# Altium schematic sheet SIM.SchDoc
size A3; SheetNumber: 12; SheetTotal: 15
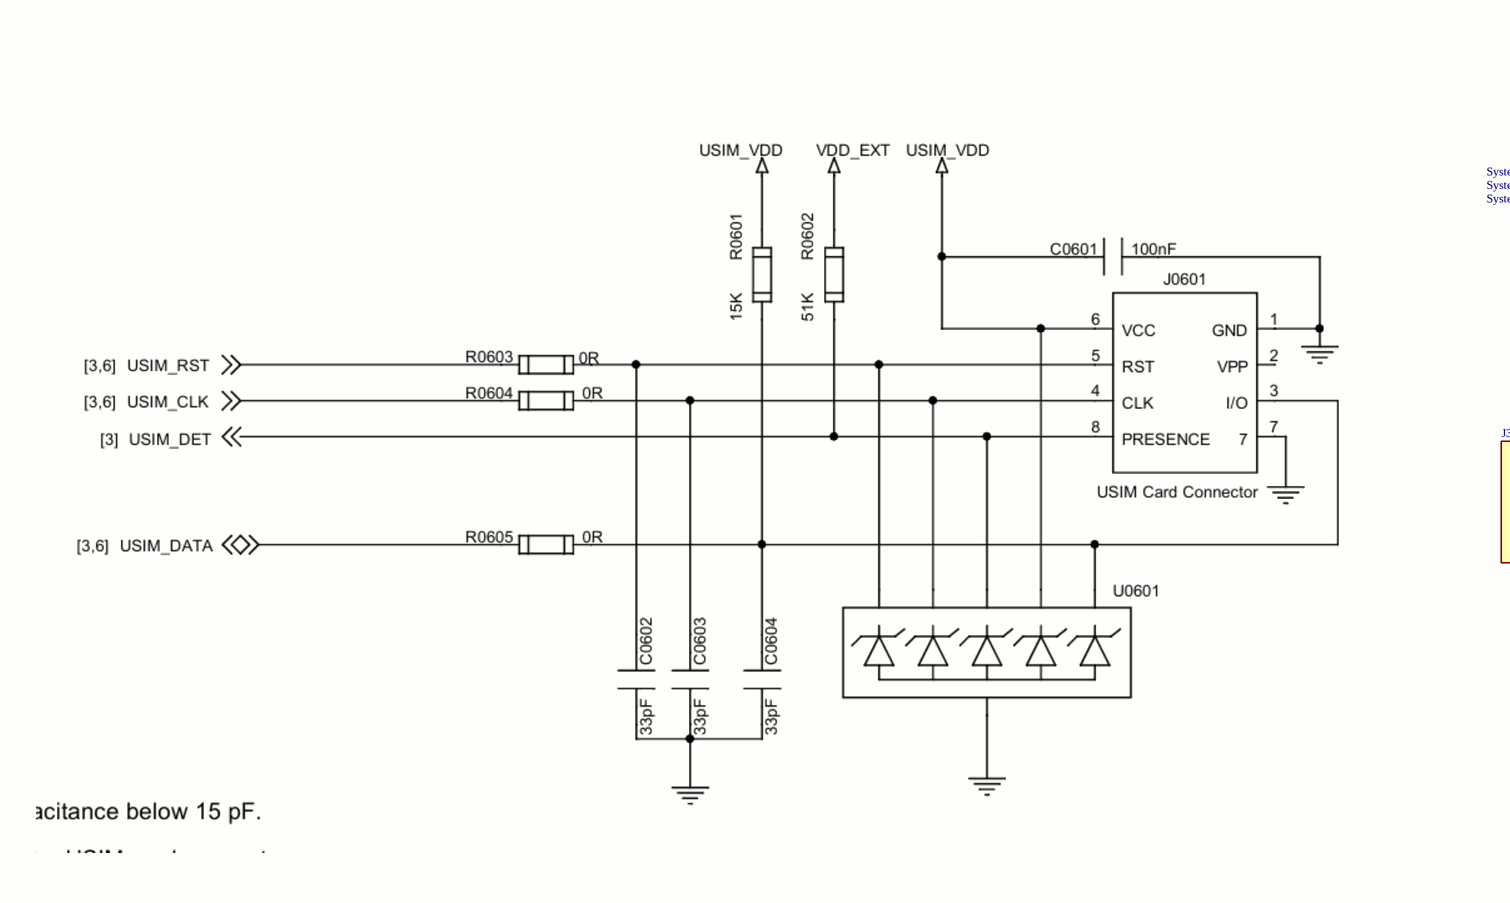
[diagram p0: SIM.SchDoc, top left]
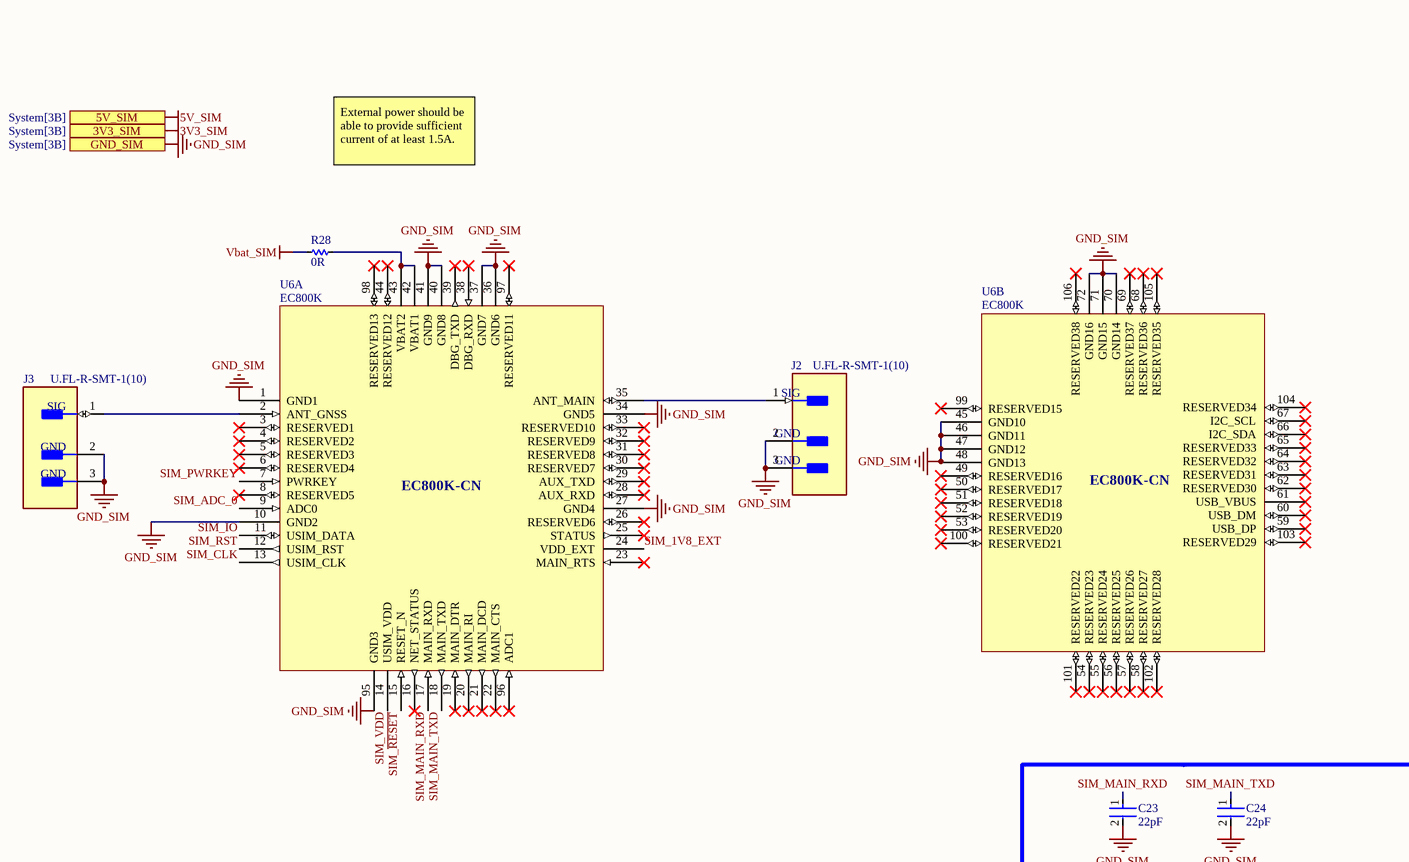
[diagram p1: SIM.SchDoc, top middle]
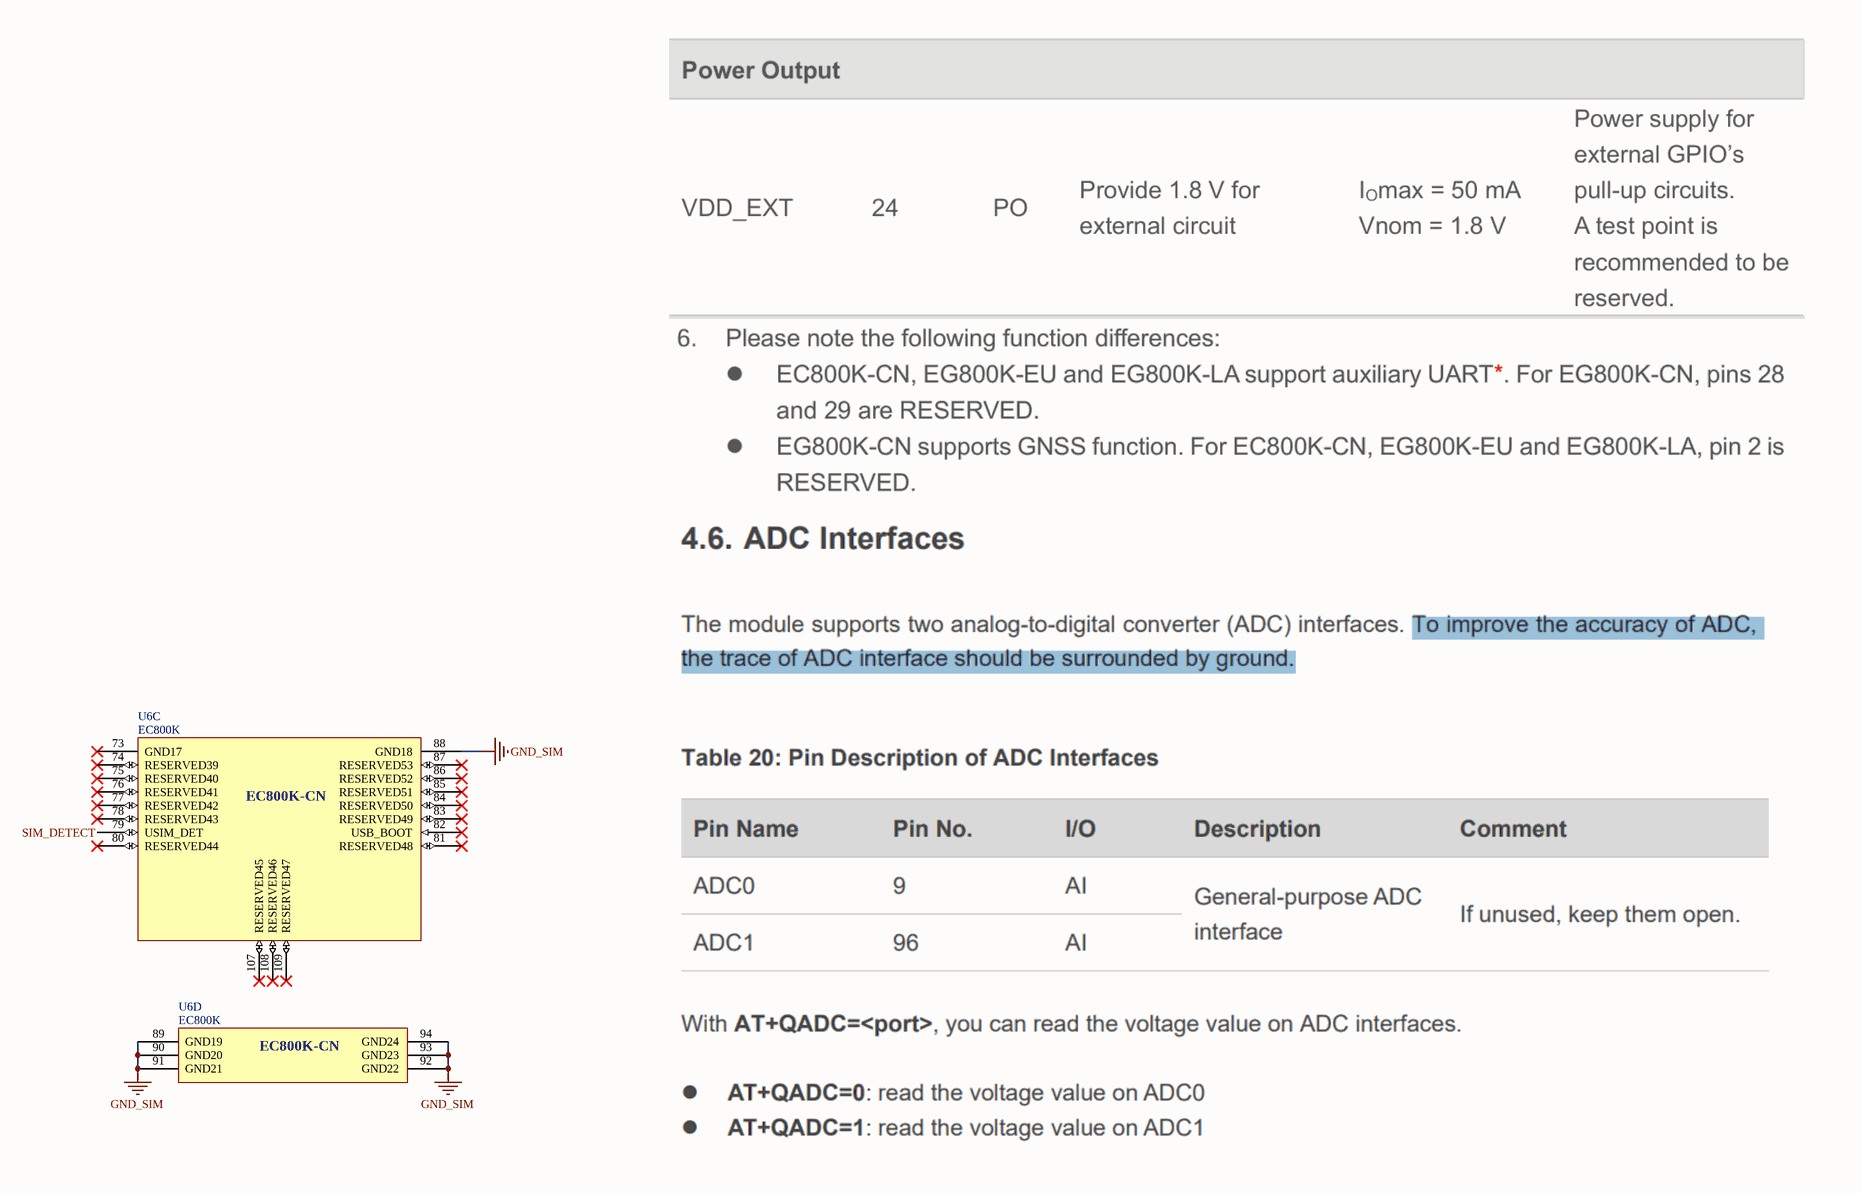
[diagram p2: SIM.SchDoc, top right]
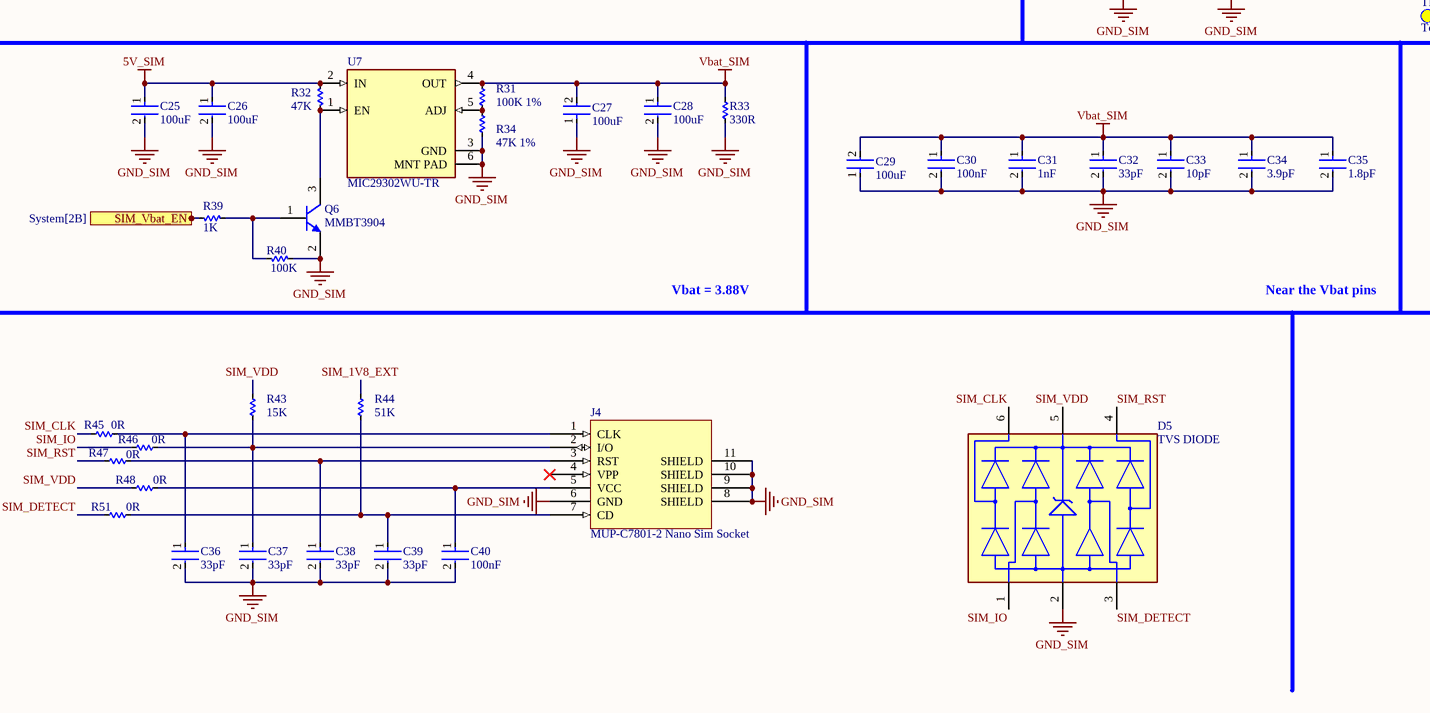
[diagram p3: SIM.SchDoc, bottom middle]
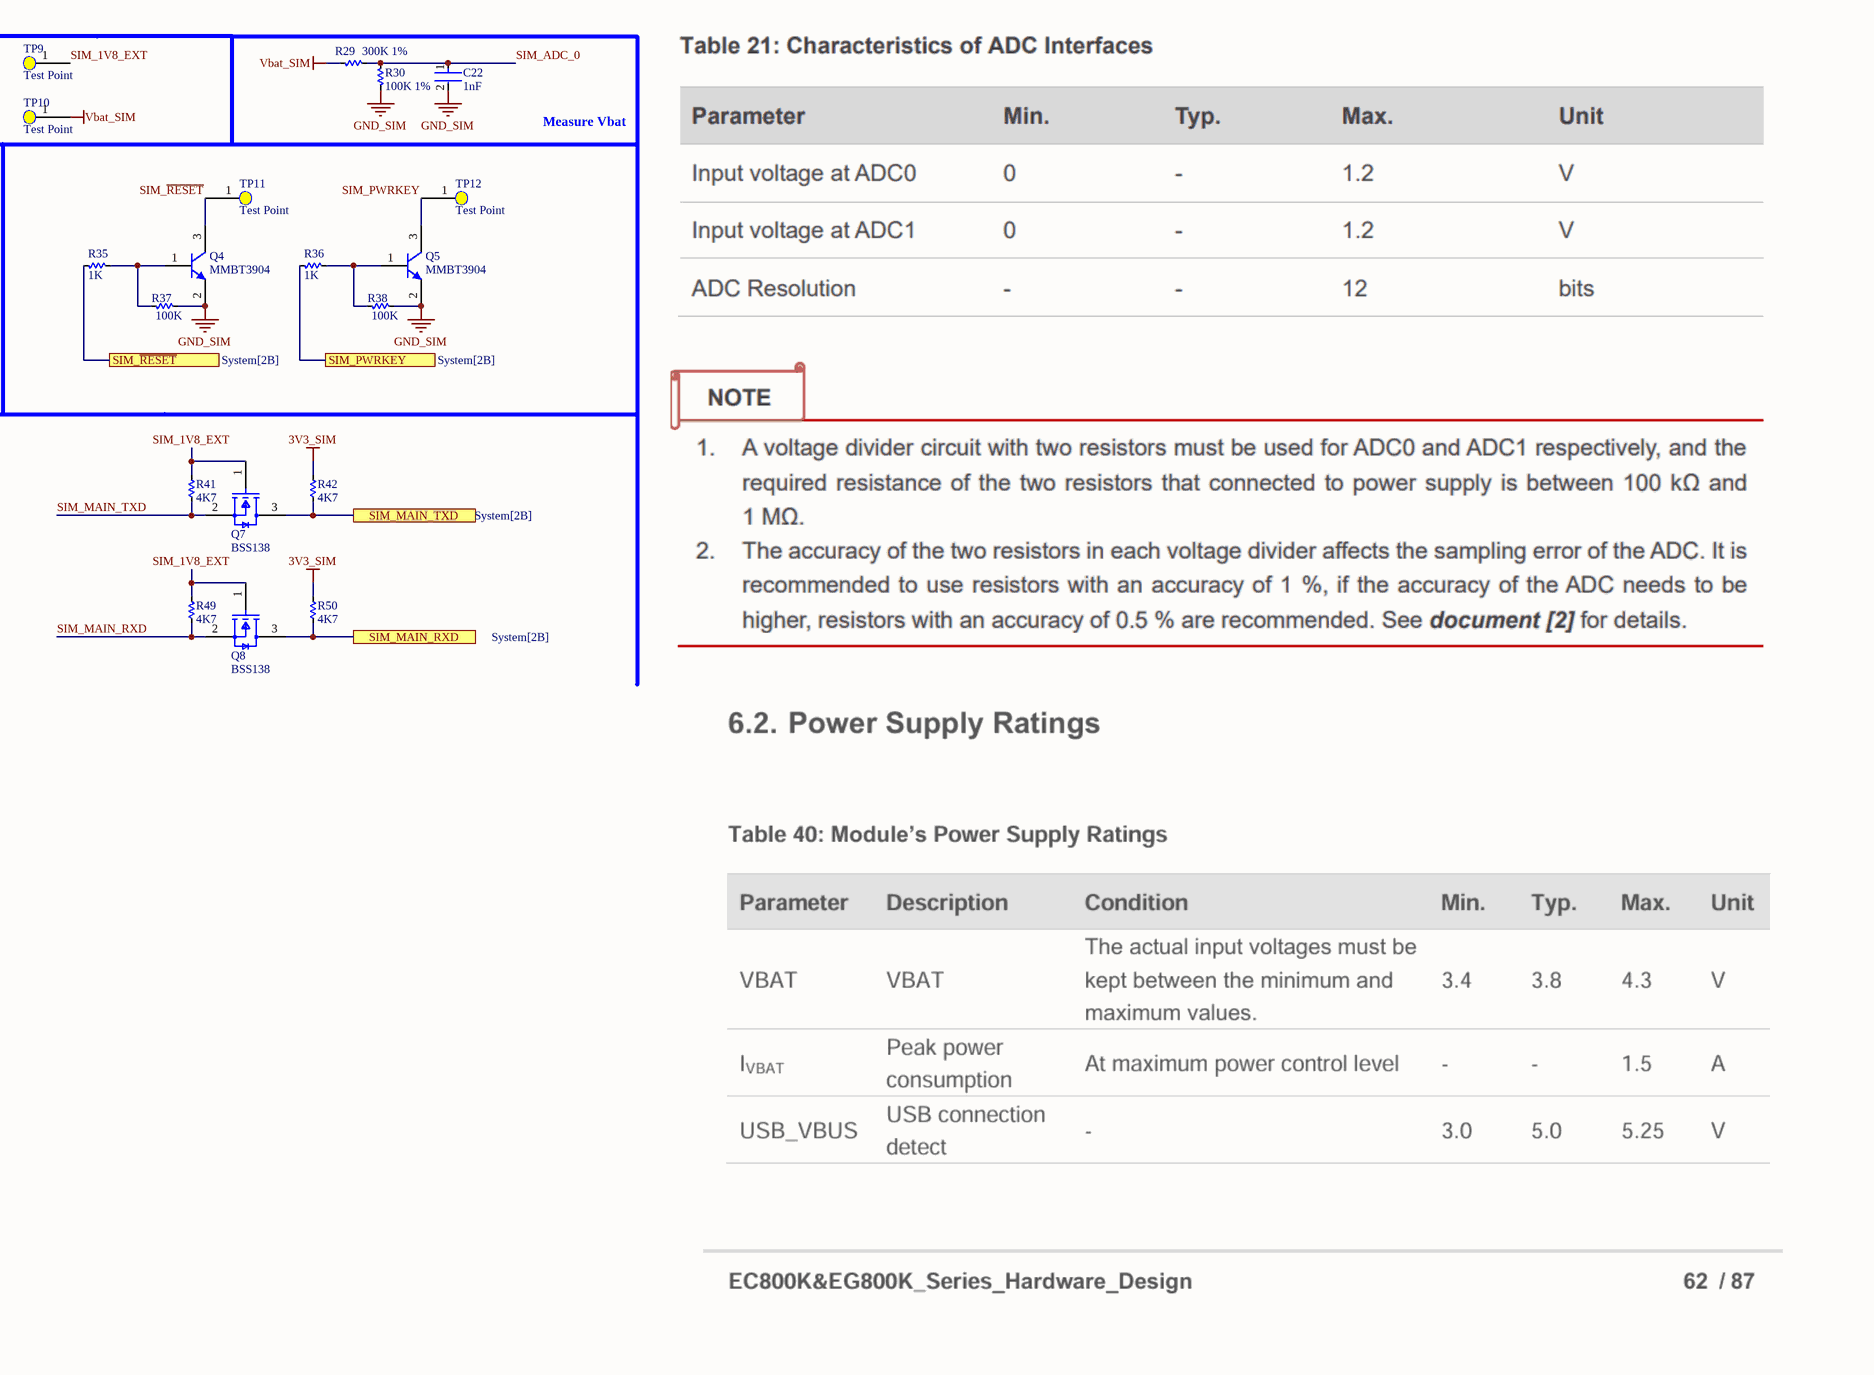
[diagram p4: SIM.SchDoc, bottom right]

## Parts
C22  1nF  [FP-GRM18-0_15-MFG]
C23  22pF  [FP-GRM188-0_1-e0_2_0_55-IPC_C]
C24  22pF  [FP-GRM188-0_1-e0_2_0_55-IPC_C]
C25  100uF  [FP-C1210C107M9PACTU-IPC_A]
C26  100uF  [FP-C1210C107M9PACTU-IPC_A]
C27  100uF  [FP-C1210C107M9PACTU-IPC_A]
C28  100uF  [FP-C1210C107M9PACTU-IPC_A]
C29  100uF  [FP-C1210C107M9PACTU-IPC_A]
C30  100nF  [FP-GRM188-0_1-e0_2_0_55-IPC_C]
C31  1nF  [FP-GRM188-0_1-e0_2_0_55-IPC_C]
C32  33pF  [FP-GRM188-0_1-e0_2_0_55-IPC_C]
C33  10pF  [FP-GRM188-0_1-e0_2_0_55-IPC_C]
C34  3.9pF  [FP-GRM188-0_1-e0_2_0_55-IPC_C]
C35  1.8pF  [FP-GRM188-0_1-e0_2_0_55-IPC_C]
C36  33pF  [FP-GRM188-0_1-e0_2_0_55-IPC_C]
C37  33pF  [FP-GRM188-0_1-e0_2_0_55-IPC_C]
C38  33pF  [FP-GRM188-0_1-e0_2_0_55-IPC_C]
C39  33pF  [FP-GRM188-0_1-e0_2_0_55-IPC_C]
C40  100nF  [FP-GRM188-0_1-e0_2_0_55-IPC_C]
D5  TVS DIODE  [FP-318G-02-MFG]
J2  U.FL-R-SMT-1(10)  [FP-U_FL-R-SMT-1_10-MFG]
J3  U.FL-R-SMT-1(10)  [FP-U_FL-R-SMT-1_10-MFG]
J4  MUP-C7801-2 Nano Sim Socket  [MCP-C7801-2]
Q4  MMBT3904  [FAIR-SOT23-3_V]
Q5  MMBT3904  [FAIR-SOT23-3_V]
Q6  MMBT3904  [FAIR-SOT23-3_V]
Q7  BSS138  [FP-318-08-IPC_B]
Q8  BSS138  [FP-318-08-IPC_B]
R28  0R  [RES-SMD-0805]
R29  300K 1%  [RES-SMD-0603]
R30  100K 1%  [RES-SMD-0603]
R31  100K 1%  [RES-SMD-0603]
R32  47K  [RES-SMD-0603]
R33  330R  [RES-SMD-0603]
R34  47K 1%  [RES-SMD-0603]
R35  1K  [RES-SMD-0603]
R36  1K  [RES-SMD-0603]
R37  100K  [RES-SMD-0603]
R38  100K  [RES-SMD-0603]
R39  1K  [RES-SMD-0603]
R40  100K  [RES-SMD-0603]
R41  4K7  [RES-SMD-0603]
R42  4K7  [RES-SMD-0603]
R43  15K  [RES-SMD-0603]
R44  51K  [RES-SMD-0603]
R45  0R  [RES-SMD-0603]
R46  0R  [RES-SMD-0603]
R47  0R  [RES-SMD-0603]
R48  0R  [RES-SMD-0603]
R49  4K7  [RES-SMD-0603]
R50  4K7  [RES-SMD-0603]
R51  0R  [RES-SMD-0603]
TP9  Test Point  [Test Point]
TP10  Test Point  [Test Point]
TP11  Test Point  [Test Point]
TP12  Test Point  [Test Point]
U6  EC800K  [EC800K]  (parts A,B,C,D of 4)
U7  MIC29302WU-TR  [FP-C04-012-MFG]

## Ports
3V3_SIM (see System[3B]), 5V_SIM (see System[3B]), GND_SIM (see System[3B]), SIM_MAIN_RXD (see System[2B]), SIM_MAIN_TXD (see System[2B]), SIM_PWRKEY (see System[2B]), SIM_Vbat_EN (see System[2B]), SIM_~{RESET} (see System[2B])

## Nets
3V3_SIM: R42.1 R50.1 ; port 3V3_SIM
5V_SIM: C25.1 C26.1 R32.2 U7.2(IN) ; port 5V_SIM
GND_SIM: C22.2 C23.2 C24.2 C25.2 C26.2 C27.1 C28.2 C29.1 C30.2 C31.2 C32.2 C33.2 C34.2 C35.2 C36.2 C37.2 C38.2 C39.2 C40.2 D5.2(VN) J2.2(GND) J2.3(GND) J3.2(GND) J3.3(GND) J4.6(GND) J4.8(SHIELD) J4.9(SHIELD) J4.10(SHIELD) J4.11(SHIELD) Q4.2(E) Q5.2(E) Q6.2(E) R30.2 R33.2 R34.2 R37.1 R38.1 R40.1 U6.1(GND1) U6.10(GND2) U6.27(GND4) U6.34(GND5) U6.36(GND6) U6.37(GND7) U6.40(GND8) U6.41(GND9) U6.45(GND10) U6.46(GND11) U6.47(GND12) U6.48(GND13) U6.70(GND14) U6.71(GND15) U6.72(GND16) U6.88(GND18) U6.89(GND19) U6.90(GND20) U6.91(GND21) U6.92(GND22) U6.93(GND23) U6.94(GND24) U6.95(GND3) U7.3(GND) U7.6(MNT_PAD) ; port GND_SIM
Vbat_SIM: C27.2 C28.1 C29.2 C30.1 C31.1 C32.1 C33.1 C34.1 C35.1 R28.2 R29.1 R31.2 R33.1 TP10.1(Test_Point) U7.4(OUT)
SIM_1V8_EXT: Q7.1(G) Q8.1(G) R41.1 R44.1 R49.1 TP9.1(Test_Point) U6.24(VDD_EXT)
SIM_ADC_0: C22.1 R29.2 R30.1 U6.9(ADC0)
SIM_CLK: D5.6(4_I/O) R45.2 U6.13(USIM_CLK)
SIM_DETECT: D5.3(2_I/O) R51.2 U6.79(USIM_DET)
SIM_IO: D5.1(1_I/O) R46.2 U6.11(USIM_DATA)
SIM_MAIN_RXD: C23.1 Q8.2(S) R49.2 U6.17(MAIN_RXD)
SIM_MAIN_RXD: Q8.3(D) R50.2 ; port SIM_MAIN_RXD  [a separate net that carries the same name]
SIM_MAIN_TXD: C24.1 Q7.2(S) R41.2 U6.18(MAIN_TXD)
SIM_MAIN_TXD: Q7.3(D) R42.2 ; port SIM_MAIN_TXD  [a separate net that carries the same name]
SIM_PWRKEY: R36.2 ; port SIM_PWRKEY
SIM_PWRKEY: Q5.3(C) TP12.1(Test_Point) U6.7(PWRKEY)  [a separate net that carries the same name]
SIM_~{RESET}: R35.2 ; port SIM_~{RESET}
SIM_~{RESET}: Q4.3(C) TP11.1(Test_Point) U6.15(RESET_N)  [a separate net that carries the same name]
SIM_RST: D5.4(3_I/O) R47.2 U6.12(USIM_RST)
SIM_Vbat_EN: R39.2 ; port SIM_Vbat_EN
SIM_VDD: D5.5(VP) R43.1 R48.2 U6.14(USIM_VDD)
NetC36_1: C36.1 J4.1(CLK) R45.1
NetC37_1: C37.1 J4.2(I/O) R43.2 R46.1
NetC38_1: C38.1 J4.3(RST) R47.1
NetC39_1: C39.1 J4.7(CD) R44.2 R51.1
NetC40_1: C40.1 J4.5(VCC) R48.1
NetJ2_1: J2.1(SIG) U6.35(ANT_MAIN)
NetJ3_1: J3.1(SIG) U6.2(ANT_GNSS)
NetQ4_1: Q4.1(B) R35.1 R37.2
NetQ5_1: Q5.1(B) R36.1 R38.2
NetQ6_1: Q6.1(B) R39.1 R40.2
NetQ6_3: Q6.3(C) R32.1 U7.1(EN)
NetR28_1: R28.1 U6.42(VBAT1) U6.43(VBAT2)
NetR31_1: R31.1 R34.1 U7.5(ADJ)

Not connected (* = marked no-connect by the designer): J4 4(VPP)*; U6 3(RESERVED1)* 4(RESERVED2)* 5(RESERVED3)* 6(RESERVED4)* 8(RESERVED5)* 16(NET_STATUS)* 19(MAIN_DTR)* 20(MAIN_RI)* 21(MAIN_DCD)* 22(MAIN_CTS)* 23(MAIN_RTS)* 25(STATUS)* 26(RESERVED6)* 28(AUX_RXD)* 29(AUX_TXD)* 30(RESERVED7)* 31(RESERVED8)* 32(RESERVED9)* 33(RESERVED10)* 38(DBG_RXD)* 39(DBG_TXD)* 44(RESERVED12)* 49(RESERVED16)* 50(RESERVED17)* 51(RESERVED18)* 52(RESERVED19)* 53(RESERVED20)* 54(RESERVED23)* 55(RESERVED24)* 56(RESERVED25)* 57(RESERVED26)* 58(RESERVED27)* 59(USB_DP)* 60(USB_DM)* 61(USB_VBUS)* 62(RESERVED30)* 63(RESERVED31)* 64(RESERVED32)* 65(RESERVED33)* 66(I2C_SDA)* 67(I2C_SCL)* 68(RESERVED36)* 69(RESERVED37)* 73(GND17)* 74(RESERVED39)* 75(RESERVED40)* 76(RESERVED41)* 77(RESERVED42)* 78(RESERVED43)* 80(RESERVED44)* 81(RESERVED48)* 82(USB_BOOT)* 83(RESERVED49)* 84(RESERVED50)* 85(RESERVED51)* 86(RESERVED52)* 87(RESERVED53)* 96(ADC1)* 97(RESERVED11)* 98(RESERVED13)* 99(RESERVED15)* 100(RESERVED21)* 101(RESERVED22)* 102(RESERVED28)* 103(RESERVED29)* 104(RESERVED34)* 105(RESERVED35)* 106(RESERVED38)* 107(RESERVED45)* 108(RESERVED46)* 109(RESERVED47)*

## Notes on the sheet
- External power should be able to provide sufficient current of at least 1.5A.
- Measure Vbat
- Vbat = 3.88V
- Near the Vbat pins
- (in symbol EC800K, part A) EC800K-CN
- (in symbol EC800K, part B) EC800K-CN
- (in symbol EC800K, part C) EC800K-CN
- (in symbol EC800K, part D) EC800K-CN

## Library data of the parts
C22 = CMP-2000-05448-2: CAP CER 10V X5R 0603; Manufacturer Part Number: GRM188R61A106KE69D; Manufacturer: Murata; Temperature Coefficient: 15%; Value: 10uF; Material: Ceramic; Tolerance: 10%; Device Class L1: Passive Components; ComponentLink2Description: Datasheet; Height: 0.95mm; Package: GRM18-0.15; Octopart: https://octopart.com/grm188r61a106ke69d-murata-22851381; Digikey Description: CAP CER 10UF 10V X5R 0603; Temperature Range High: +85°C; Temperature Range Low: -55°C; Temperature Characteristic: X5R; Capacitance: 10uF; RoHS: TRUE; Device Class L2: Capacitors; ComponentLink2URL: https://search.murata.co.jp/Ceramy/image/img/A01X/G101/ENG/GRM188R61A106KE69-01A.pdf; Device Class L3: Ceramic Capacitors; Lead Free: Yes; Mouser Description: Multilayer Ceramic Capacitors MLCC - SMD/SMT 0603 10uF 10volts X5R + - 10%; Category: Cap; Voltage Rating: 10V; Temperature: -55°C to +85°C; Automotive: No
C23 C24 C30-C40 = CMP-2006-02792-2: Chip Multilayer Ceramic Capacitors for General Purpose, 0603, 10uF, X5R, 15%, 20%, 6.3V; Packaging: Tape and Reel; Voltage Rating (DC): 6.3V; Width: 0.031inch; Termination: SMD/SMT; Dielectric: X5R; Package Quantity: 4000; Voltage Rating: 6.3V; Capacitance: 10uF; Case/Package: 0603; Min Operating Temperature: -55°C; Voltage: 6.3V; Length: 1.6mm; Thickness: 0.035inch; Lead Free: Lead Free; Depth: 0.8mm; Case Code (Imperial): 0603; Max Operating Temperature: 85°C; Material: Ceramic; Height: 0.8mm; Tolerance: 20%; Mount: Surface Mount; REACH SVHC: No SVHC; Radiation Hardening: No; Case Code (Metric): 1608
C25-C29 = CMP-2000-06018-2: SMD 1210 100UF 107K 3225 25V 20% X5R; Voltage Rating (DC): 6.3V; Dissipation Factor: 5%; Dielectric Material: Ceramic; Termination: SMD/SMT; REACH SVHC: No SVHC; Thickness: 0.11inch; Packaging: Tape and Reel; Series: C; Width: 2.5mm; Voltage: 6.3V; Contact Plating: Tin; Package Quantity: 1; Case/Package: 1210; Min Operating Temperature: -55°C; Height: 2.5mm; Radiation Hardening: No; Capacitance: 100uF; Case Code (Metric): 3225; Depth: 2.5mm; Construction: Flat; Max Operating Temperature: 85°C; Number of Pins: 2; Mount: Surface Mount; Lead Free: Lead Free; RoHS Compliant: Yes; Voltage Rating: 6.3V; Dielectric: X5R; Length: 3.2mm; Case Code (Imperial): 1210; Tolerance: 20%
D5 = CMP-00278-81858208-1: NSP4201MR6T1G TVS DIODE 5VWM 12VC 6TSOP; Manufacturer Lifecycle Status: ACTIVE; Direction: Unidirectional; Capacitance: 3pF; Max Junction Temperature (Tj): 125°C; Breakdown Voltage: 6V; Peak Pulse Current: 25A; Number of Channels: 4; Reverse Standoff Voltage: 5V; Peak Pulse Power: 500W; Clamping Voltage: 12V; NexarPartId: 81858208; Height: 1.1mm; Min Operating Temperature: -40°C; RoHS: Compliant; Max Operating Temperature: 125°C; Schedule B: 8536300000; Lifecycle Status: Production; ComponentLink1Description: New link; ComponentLink1URL: https://linhkien.cxtvn.com/4420-nsp4201mr6t1g-tvs-diode-5vwm-12vc-6tsop.html
J2 J3 = CMP-2000-05152-3: CONN U.FL RCPT STR 50 OHM SMD; Max Frequency: 6GHz; Connector Type: Coaxial; Body Plating: Silver; Body Material: Bronze; Impedance: 50R; Dielectric Material: Polymer; Insulation Resistance: 500MR; Gender: Male; Packaging: Cut Tape; Length: 3mm; Package Quantity: 2500; Termination: Solder; Lead Free: Lead Free; Series: U.FL; Min Operating Temperature: -40°C; Fastening Type: Snap; Contact Material: Brass; Orientation: Straight; Wire/Cable Type: Coaxial; Frequency: 6GHz; Contact Plating: Gold; Depth: 3.1mm; Weight: 0.001764oz; Max Operating Temperature: 90°C; Radiation Hardening: No; REACH SVHC: No SVHC; Mount: Surface Mount; Housing Color: Beige
Q4-Q6 = CMP-1670-00008-1: NPN General Purpose Amplifier, 40 V, 0.2 A, -55 to 150 degC, 3-Pin SOT23, RoHS, Tape and Reel; Tolerance: 30ppm; Capacitance: 1.8E-11 f; Frequency: 12.288 MHz; ESR: 40 Ohm; Load Capacitance: 18 pF; REACH SVHC: No SVHC; Pins: 4; ComponentLink3URL: http://www.fairchildsemi.com/dwg/MA/MA03D.pdf; PackageDescription: 3-Pin Small Outline Transistor, Body 2.92 x 1.325 mm, Pitch 0.95 mm; ComponentLink1URL: https://www.fairchildsemi.com/; Max Operating Temperature: 70degC; PackageReference: SOT23-3; ComponentLink1Description: Manufacturer URL; Width: 0.126 inch; Min Operating Temperature: -20degC; DatasheetVersion: Rev. 1.1.0, 10/2014; Mount: Surface Mount; Height: 0.041 inch; Package Quantity: 1000; Frequency Tolerance: 30ppm; Packaging: Tape and Reel; ComponentLink2URL: https://www.fairchildsemi.com/datasheets/MM/MMBT3904.pdf; RoHSCompliant: True; ComponentLink3Description: Package Specification; ComponentLink2Description: Datasheet; Length: 0.197 inch
Q7 Q8 = CMP-07173-000101-1: MOSFET N-CH 50V 220MA SOT-23; Turn-Off Delay Time: 20ns; Element Configuration: Single; Rds On Max: 3.5R; Gate to Source Voltage (Vgs): 20V; Threshold Voltage: 1.3V; Number of Elements: 1; Power Dissipation: 360mW; Rise Time: 9ns; Turn-On Delay Time: 2.5ns; Input Capacitance: 27pF; On-State Resistance: 6R; Lead Free: Lead Free; Length: 2.92mm; Width: 1.3mm; Drain to Source Breakdown Voltage: 50V; Min Operating Temperature: -55°C; REACH SVHC: No SVHC; Packaging: Tape and Reel; Radiation Hardening: No; Height: 0.93mm; Drain to Source Voltage (Vdss): 50V; Current Rating: 220mA; Voltage Rating (DC): 50V; Weight: 0.03g; Continuous Drain Current (ID): 220mA; Number of Pins: 3; Nominal Vgs: 1.3V; Max Power Dissipation: 360mW; Fall Time: 9ns; Drain to Source Resistance: 3.5R; Contact Plating: Tin; Case/Package: SOT-23; Package Quantity: 1; Dual Supply Voltage: 50V; Mount: Surface Mount; Termination: SMD/SMT; Max Operating Temperature: 150°C
R28 = Res-SMD: Res 0805 5%; Manufacturer: Generic Components; Class: Passive; Published: 08/06/2000; Publisher: Altium Hobart Technology Centre
R29 R30 R33 = Res-SMD: Res 0603 1%; Manufacturer: Generic Components; Class: Passive; Published: 08/06/2000; Publisher: Altium Hobart Technology Centre
R31 R32 R34-R51 = Res-SMD: Res 0603 5%; Manufacturer: Generic Components; Class: Passive; Published: 08/06/2000; Publisher: Altium Hobart Technology Centre
U7 = CMP-06324-000007-1: MIC29302WU IC REG LINEAR POS ADJ 3A TO263-5; Manufacturer: Microchip; Output Voltage: 3.3-12V; Output Type: AdjustableProgrammable; Max Junction Temp: +125°C; Standoff Height: 0mm; Accuracy Percentage: 1%; Max Supply Voltage: 26V; Nominal Supply Current: 10-37mA; Number Of Outputs: 1; Dropout Voltage: 370mV; Min Supply Voltage: 2.25V; ComponentLink2URL: http://ww1.microchip.com/downloads/en/DeviceDoc/MIC2915x-30x-50x-75x-High-Current-Low-Dropout-Regulators-DS20005685B.pdf; Device Class L1: Integrated Circuits (ICs); Digikey Description: IC REG LINEAR POS ADJ 3A TO263-5; Device Class L2: Power Management ICs; Lead Free: Yes; Mouser Description: LDO Voltage Regulators; Package: C04-012; Temperature: -40°C to +125°C; ComponentLink2Description: Datasheet; Temperature Range High: +125°C; Automotive: No; Device Class L3: Voltage Regulators - Linear; Category: IC; Temperature Range Low: -40°C; RoHS: TRUE; Output Current: 3A; Octopart: https://octopart.com/mic29302wu-tr-microchip-66801318; Manufacturer Part Number: MIC29302WU-TR; Height: 0.2inch; ComponentLink3Description: New link; ComponentLink3URL: https://linhkien.cxtvn.com/1277-mic29302wu-ic-reg-linear-pos-adj-3a-to263-5.html
J4 = MUP-C7801-2 Nano Sim Socket: ComponentLink1Description: New link; ComponentLink1URL: https://linhkien.cxtvn.com/9704-mup-c7801-2-socket-nano-sim-7p.html